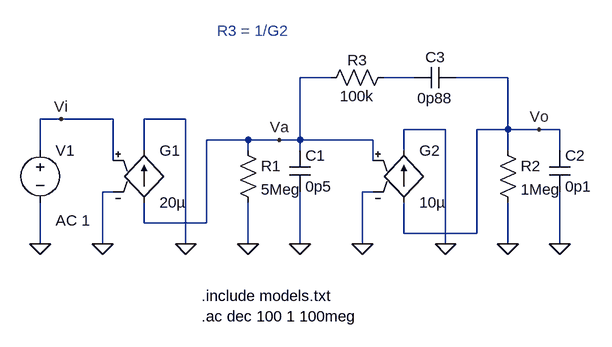
[diagram p0: schematic 1.asc]
1.asc, the LTspice schematic file:
Version 4.1
SHEET 1 920 680
WIRE 496 32 448 32
WIRE 624 32 576 32
WIRE 768 32 688 32
WIRE 80 96 48 96
WIRE 160 96 80 96
WIRE 272 96 208 96
WIRE 672 112 608 112
WIRE 768 112 768 32
WIRE 768 112 720 112
WIRE 816 112 768 112
WIRE 848 112 816 112
WIRE 368 128 304 128
WIRE 416 128 368 128
WIRE 448 128 448 32
WIRE 448 128 416 128
WIRE 560 128 448 128
WIRE 48 144 48 96
WIRE 208 144 208 96
WIRE 368 144 368 128
WIRE 448 144 448 128
WIRE 608 144 608 112
WIRE 768 144 768 112
WIRE 848 144 848 112
WIRE 160 160 160 96
WIRE 560 160 560 128
WIRE 160 208 144 208
WIRE 560 208 544 208
WIRE 208 256 208 224
WIRE 304 256 304 128
WIRE 304 256 208 256
WIRE 608 272 608 224
WIRE 720 272 720 112
WIRE 720 272 608 272
WIRE 48 288 48 224
WIRE 144 288 144 208
WIRE 272 288 272 96
WIRE 368 288 368 224
WIRE 448 288 448 208
WIRE 544 288 544 208
WIRE 672 288 672 112
WIRE 768 288 768 224
WIRE 848 288 848 208
FLAG 48 288 0
FLAG 144 288 0
FLAG 272 288 0
FLAG 368 288 0
FLAG 448 288 0
FLAG 672 288 0
FLAG 768 288 0
FLAG 848 288 0
FLAG 544 288 0
FLAG 816 112 Vo
FLAG 416 128 Va
FLAG 80 96 Vi
SYMBOL voltage 48 128 R0
WINDOW 123 24 124 Left 2
WINDOW 39 0 0 Left 0
SYMATTR InstName V1
SYMATTR Value ""
SYMATTR Value2 AC 1
SYMBOL g 208 128 R0
SYMATTR InstName G1
SYMATTR Value 20µ
SYMBOL res 352 128 R0
SYMATTR InstName R1
SYMATTR Value 5Meg
SYMBOL cap 432 144 R0
SYMATTR InstName C1
SYMATTR Value 0p5
SYMBOL g 608 128 R0
SYMATTR InstName G2
SYMATTR Value 10µ
SYMBOL res 752 128 R0
SYMATTR InstName R2
SYMATTR Value 1Meg
SYMBOL cap 832 144 R0
SYMATTR InstName C2
SYMATTR Value 0p1
SYMBOL res 480 48 R270
WINDOW 0 27 56 VTop 2
WINDOW 3 3 56 VBottom 2
SYMATTR InstName R3
SYMATTR Value 100k
SYMBOL cap 624 16 M90
WINDOW 0 0 32 VBottom 2
WINDOW 3 32 32 VTop 2
SYMATTR InstName C3
SYMATTR Value 0p88
TEXT 296 368 Left 2 !.include models.txt
TEXT 296 400 Left 2 !.ac dec 100 1 100meg
TEXT 320 -40 Left 2 ;R3 = 1/G2

The netlist it stands for:
* 1.asc
V1 Vi 0 AC 1
G1 Va 0 Vi 0 20µ
R1 Va 0 5Meg
C1 Va 0 0p5
G2 Vo 0 Va 0 10µ
R2 Vo 0 1Meg
C2 Vo 0 0p1
R3 Va N001 100k
C3 N001 Vo 0p88
.include models.txt
.ac dec 100 1 100meg
* R3 = 1/G2
.backanno
.end

* Results of the author's LTspice run, read from the files saved beside the schematic
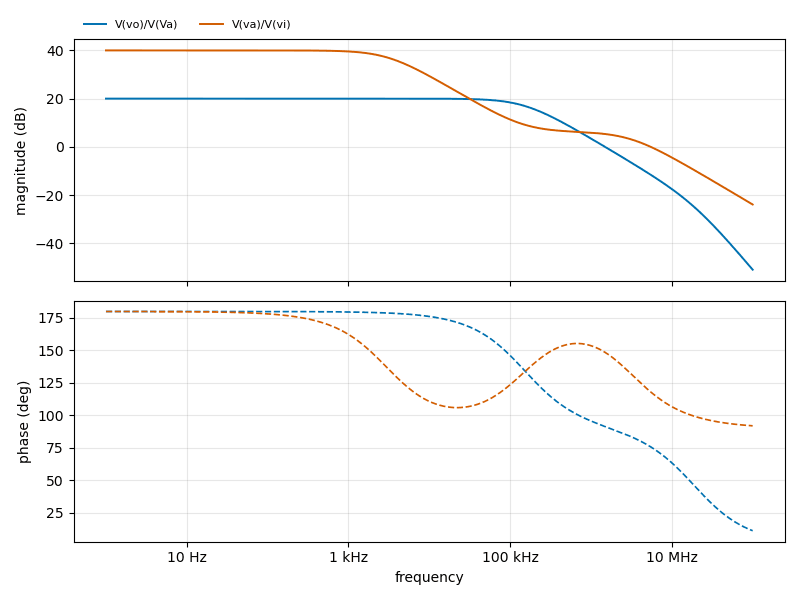
[diagram p1: AC Analysis of 1.asc, plotted from the saved traces]
* AC Analysis, 1 run:
*   V(vo)/V(Va): 20.00 dB at 1 Hz, -50.97 dB at 100 MHz, peak 20.00 dB at 1 Hz, 3 dB below the peak at 150.2 kHz
*   V(va)/V(vi): 40.00 dB at 1 Hz, -23.93 dB at 100 MHz, peak 40.00 dB at 1 Hz, 3 dB below the peak at 3.067 kHz